# EAGLE design LoRa-Power (EAGLE 7.7.0)
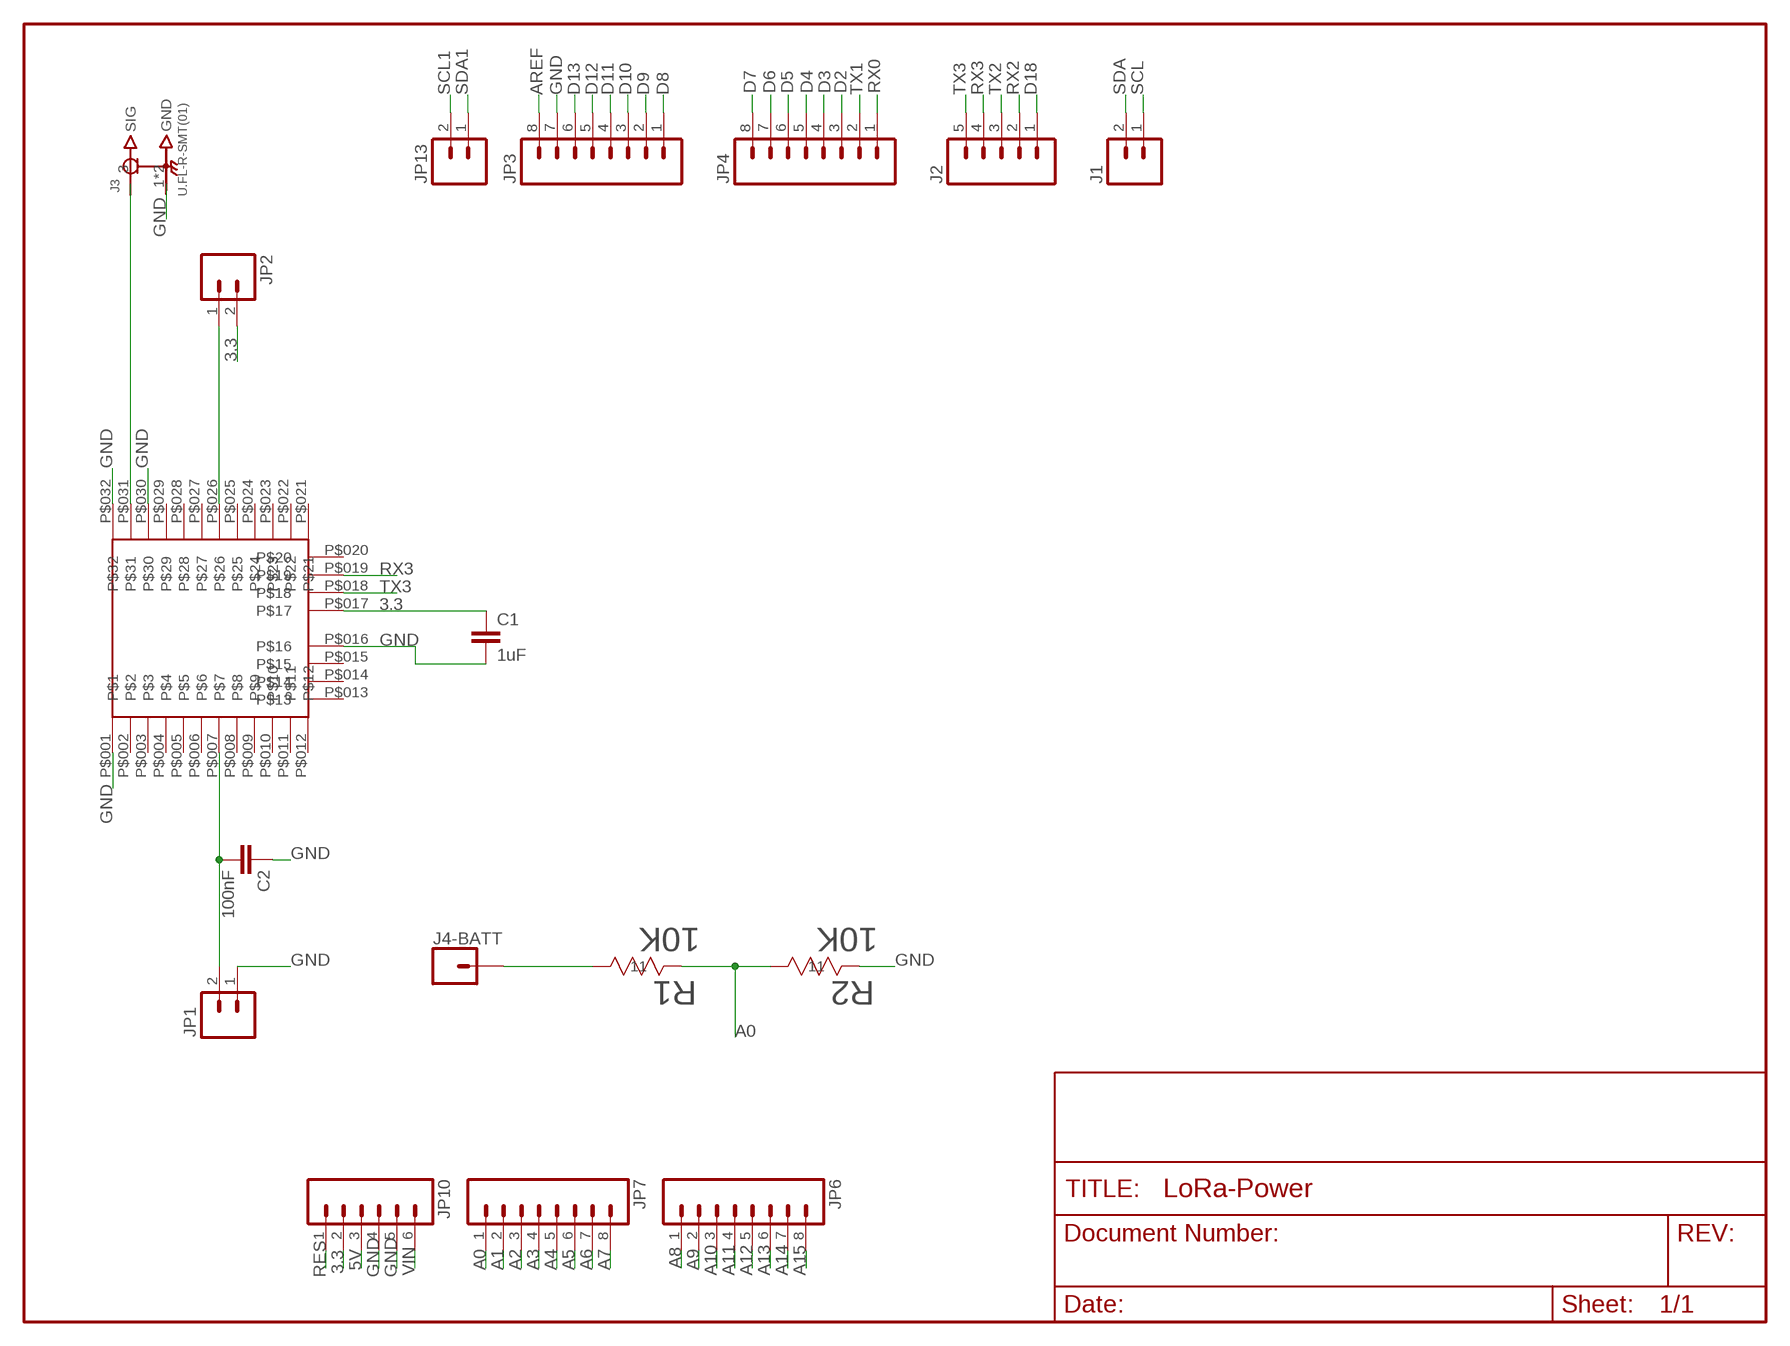
[diagram p0: schematic, sheet 1, part 1 of 2]
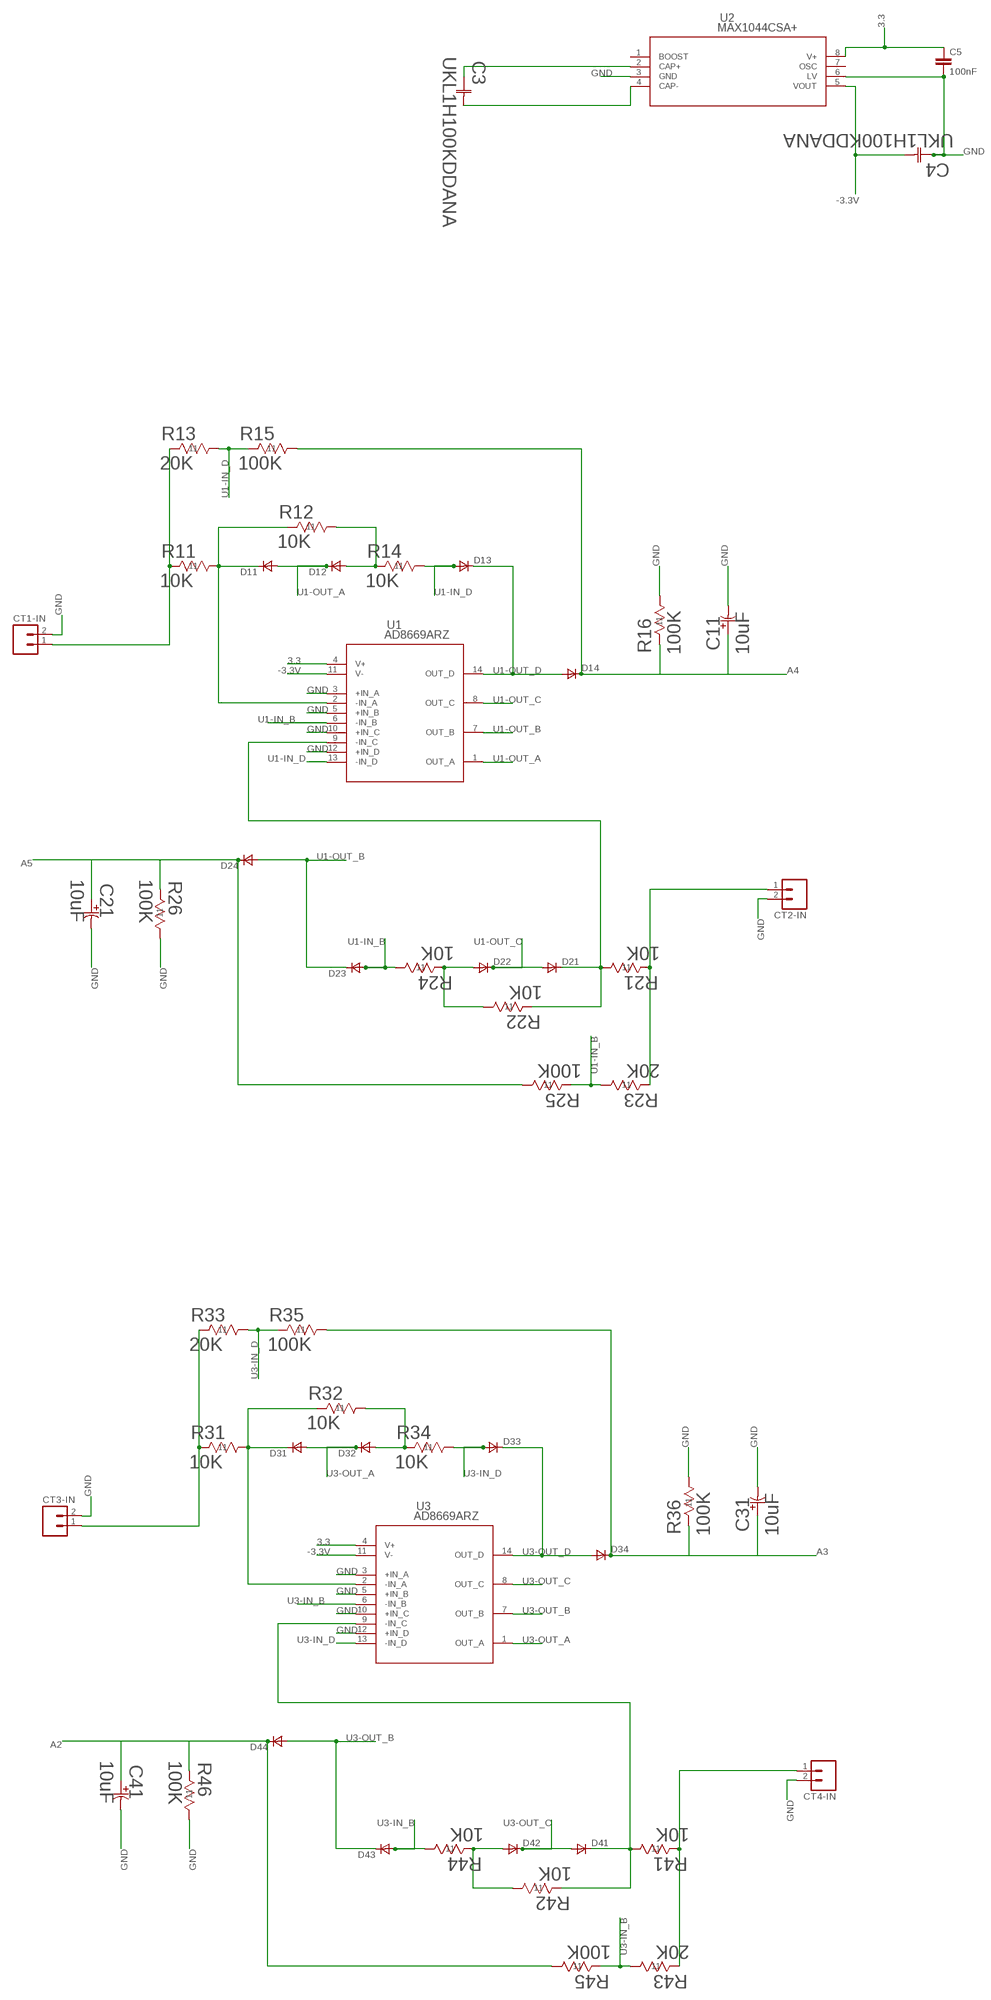
[diagram p1: schematic, sheet 1, part 2 of 2]

## Parts
C1  1uF  C-EUC0603K  [C0603K]
C2  100nF  C-EUC0603K  [C0603K]
C3  UKL1H100KDDANA  [U1-E]
C4  UKL1H100KDDANA  [U1-E]
C5  100nF  C-EUC1206K  [C1206K]
C11  10uF  C1206C106J8RACTU  [C1206]
C21  10uF  C1206C106J8RACTU  [C1206]
C31  10uF  C1206C106J8RACTU  [C1206]
C41  10uF  C1206C106J8RACTU  [C1206]
CT1-IN  M02LOCK  [1X02_LOCK]
CT2-IN  M02LOCK  [1X02_LOCK]
CT3-IN  M02LOCK  [1X02_LOCK]
CT4-IN  M02LOCK  [1X02_LOCK]
D11  DSOT23  [SOT-23]
D12  DSOT23  [SOT-23]
D13  DSOT23  [SOT-23]
D14  DSOT23  [SOT-23]
D21  DSOT23  [SOT-23]
D22  DSOT23  [SOT-23]
D23  DSOT23  [SOT-23]
D24  DSOT23  [SOT-23]
D31  DSOT23  [SOT-23]
D32  DSOT23  [SOT-23]
D33  DSOT23  [SOT-23]
D34  DSOT23  [SOT-23]
D41  DSOT23  [SOT-23]
D42  DSOT23  [SOT-23]
D43  DSOT23  [SOT-23]
D44  DSOT23  [SOT-23]
IM1  IM880B  [IM880B]
J1  M02LOCK  [1X02_LOCK]
J2  M05LOCK  [1X05_LOCK]
J3  U.FL-R-SMT(01)  [HRS_U.FL-R-SMT(01)]
J4-BATT  CONN_01  [1X01]
JP1  M02LOCK  [1X02_LOCK]
JP2  M02LOCK  [1X02_LOCK]
JP3  M08LOCK  [1X08_LOCK]
JP4  M08LOCK  [1X08_LOCK]
JP6  M08LOCK  [1X08_LOCK]
JP7  M08LOCK  [1X08_LOCK]
JP10  M06LOCK  [1X06_LOCK]
JP13  M02LOCK  [1X02_LOCK]
R1  10K  ERA-8AEB103V  [1206]
R2  10K  ERA-8AEB103V  [1206]
R11  10K  ERA-8AEB103V  [1206]
R12  10K  ERA-8AEB103V  [1206]
R13  20K  ERA-8AEB103V  [1206]
R14  10K  ERA-8AEB103V  [1206]
R15  100K  ERA-8AEB103V  [1206]
R16  100K  ERA-8AEB103V  [1206]
R21  10K  ERA-8AEB103V  [1206]
R22  10K  ERA-8AEB103V  [1206]
R23  20K  ERA-8AEB103V  [1206]
R24  10K  ERA-8AEB103V  [1206]
R25  100K  ERA-8AEB103V  [1206]
R26  100K  ERA-8AEB103V  [1206]
R31  10K  ERA-8AEB103V  [1206]
R32  10K  ERA-8AEB103V  [1206]
R33  20K  ERA-8AEB103V  [1206]
R34  10K  ERA-8AEB103V  [1206]
R35  100K  ERA-8AEB103V  [1206]
R36  100K  ERA-8AEB103V  [1206]
R41  10K  ERA-8AEB103V  [1206]
R42  10K  ERA-8AEB103V  [1206]
R43  20K  ERA-8AEB103V  [1206]
R44  10K  ERA-8AEB103V  [1206]
R45  100K  ERA-8AEB103V  [1206]
R46  100K  ERA-8AEB103V  [1206]
U1  AD8669ARZ  [R_14]
U2  MAX1044CSA+  [21-0041B_8]
U3  AD8669ARZ  [R_14]

## Nets
3.3: C1.1 C5.1 IM1.P$017 JP2.2 JP10.2 U1.4(V+) U2.8(V+) U3.4(V+)
5V: JP10.3
-3.3V: C4.2 U1.11(V-) U2.5(VOUT) U3.11(V-)
A0: JP7.1 R1.1 R2.2
A1: JP7.2
A2: C41.1 D44.1(C) JP7.3 R45.2 R46.1
A3: C31.1 D34.1(C) JP7.4 R35.2 R36.1
A4: C11.1 D14.1(C) JP7.5 R15.2 R16.1
A5: C21.1 D24.1(C) JP7.6 R25.2 R26.1
A6: JP7.7
A7: JP7.8
A8: JP6.1
A9: JP6.2
A10: JP6.3
A11: JP6.4
A12: JP6.5
A13: JP6.6
A14: JP6.7
A15: JP6.8
AREF: JP3.8
D2: JP4.3
D3: JP4.4
D4: JP4.5
D5: JP4.6
D6: JP4.7
D7: JP4.8
D8: JP3.1
D9: JP3.2
D10: JP3.3
D11: JP3.4
D12: JP3.5
D13: JP3.6
D18: J2.1
GND: C1.2 C2.1 C4.1 C5.2 C11.2 C21.2 C31.2 C41.2 CT1-IN.2 CT2-IN.2 CT3-IN.2 CT4-IN.2 IM1.P$001 IM1.P$016 IM1.P$030 IM1.P$032 J3.1(GND) J3.2(GND) JP1.1 JP3.7 JP10.4 JP10.5 R2.1 R16.2 R26.2 R36.2 R46.2 U1.3(+IN_A) U1.5(+IN_B) U1.10(+IN_C) U1.12(+IN_D) U2.3(GND) U2.6(LV) U3.3(+IN_A) U3.5(+IN_B) U3.10(+IN_C) U3.12(+IN_D)
N$1: IM1.P$031 J3.3(SIG)
N$2: C2.2 IM1.P$007 JP1.2
N$3: IM1.P$026 JP2.1
N$4: C3.1 U2.2(CAP+)
N$5: C3.2 U2.4(CAP-)
N$6: CT1-IN.1 R11.1 R13.1
N$7: D11.1(C) R11.2 R12.1 U1.2(-IN_A)
N$8: D12.3(A) R12.2 R14.1
N$9: CT2-IN.1 R21.1 R23.1
N$10: D21.1(C) R21.2 R22.1 U1.9(-IN_C)
N$11: D22.3(A) R22.2 R24.1
N$12: CT3-IN.1 R31.1 R33.1
N$13: D31.1(C) R31.2 R32.1 U3.2(-IN_A)
N$14: D32.3(A) R32.2 R34.1
N$15: CT4-IN.1 R41.1 R43.1
N$16: D41.1(C) R41.2 R42.1 U3.9(-IN_C)
N$17: D42.3(A) R42.2 R44.1
N$18: J4-BATT.1 R1.2
RES: JP10.1
RX0: JP4.1
RX2: J2.2
RX3: IM1.P$019 J2.4
SCL: J1.1
SCL1: JP13.2
SDA: J1.2
SDA1: JP13.1
TX1: JP4.2
TX2: J2.3
TX3: IM1.P$018 J2.5
U1-IN_B: D23.3(A) R23.2 R24.2 R25.1 U1.6(-IN_B)
U1-IN_D: D13.3(A) R13.2 R14.2 R15.1 U1.13(-IN_D)
U1-OUT_A: D11.3(A) D12.1(C) U1.1(OUT_A)
U1-OUT_B: D23.1(C) D24.3(A) U1.7(OUT_B)
U1-OUT_C: D21.3(A) D22.1(C) U1.8(OUT_C)
U1-OUT_D: D13.1(C) D14.3(A) U1.14(OUT_D)
U3-IN_B: D43.3(A) R43.2 R44.2 R45.1 U3.6(-IN_B)
U3-IN_D: D33.3(A) R33.2 R34.2 R35.1 U3.13(-IN_D)
U3-OUT_A: D31.3(A) D32.1(C) U3.1(OUT_A)
U3-OUT_B: D43.1(C) D44.3(A) U3.7(OUT_B)
U3-OUT_C: D41.3(A) D42.1(C) U3.8(OUT_C)
U3-OUT_D: D33.1(C) D34.3(A) U3.14(OUT_D)
VIN: JP10.6
Unconnected: IM1.P$002 IM1.P$003 IM1.P$004 IM1.P$005 IM1.P$006 IM1.P$008 IM1.P$009 IM1.P$010 IM1.P$011 IM1.P$012 IM1.P$013 IM1.P$014 IM1.P$015 IM1.P$020 IM1.P$021 IM1.P$022 IM1.P$023 IM1.P$024 IM1.P$025 IM1.P$027 IM1.P$028 IM1.P$029 U2.1(BOOST) U2.7(OSC)

## Library data of the parts
C1 C2 = resistor:C-EU: CAPACITOR, European symbol
C3 C4 = CAP-ELT-UKL1H100K:UKL1H100KDDANA; MANUFACTURER_PART_NUMBER: UKL1H100KDDANA; VENDOR: Nichicon
C5 = rcl:C-EU: CAPACITOR, European symbol
C11 C21 C31 C41 = kemet-cap-cer:C1206C106J8RACTU; MANUFACTURER_PART_NUMBER: C1206C106J8RACTU; VENDOR: KEMET
CT1-IN CT2-IN CT3-IN CT4-IN J1 JP13 = SparkFun-Connectors:M02: Standard 2-pin 0.1" header. Use with - straight break away headers ( PRT-00116) - right angle break away headers (PRT-00553) - swiss pins (PRT-00743) - machine pins (PRT-00117) - female headers (PRT-00115) Molex polarized connector foot print use with: PRT-08233 with associated crimp pins and housings. 2.54_SCREWTERM for use with PRT-10571. 3.5mm Screw Terminal footprints for PRT-08084 5mm Screw Terminal footprints for use with PRT-08432
D11-D14 D21-D24 D31-D34 D41-D44 = zetex:D: DIODE; MPN: CDSOT23-T03; OC_FARNELL: 1824866; OC_NEWARK: 75K7096
IM1 = IM880B:IM880B
J2 = SparkFun-Connectors:M05: Header 5 Standard 5-pin 0.1" header. Use with straight break away headers (SKU : PRT-00116), right angle break away headers (PRT-00553), swiss pins (PRT-00743), machine pins (PRT-00117), and female headers (PRT-00115). Molex polarized connector foot print use with SKU : PRT-08230 with associated crimp pins and housings.
J3 = U.FL-R-SMT_01_:U.FL-R-SMT(01): U.FL Series 6 Ghz 50 Ohm Ultra-small SMT Coaxial Cable Receptacle; AVAILABILITY: Good; DESCRIPTION: U.FL Series 6 Ghz 50 Ohm Ultra-small SMT Coaxial Cable Receptacle; MF: Hirose; MP: U.FL-R-SMT(01); PACKAGE: None; PRICE: 0.86 USD
J4-BATT = SparkFun-Connectors:CONN_01: Single connection point. Often used as Generic Header-pin footprint for 0.1 inch spaced/style header connections On any of the 0.1 inch spaced packages, you can populate with these: Break Away Headers - Straight <https://www.sparkfun.com/products/116> (PRT-00116) Break Away Male Headers - Right Angle <https://www.sparkfun.com/products/553> (PRT-00553) Female Headers <https://www.sparkfun.com/products/115> (PRT-00115) Break Away Headers - Machine Pin <https://www.sparkfun.com/products/117> (PRT-00117) Break Away Female Headers - Swiss Machine Pin <https://www.sparkfun.com/products/743> (PRT-00743) This device is also useful as a general connection point to wire up your design to another part of your project. Our various solder wires solder well into these plated through hole pads. Hook-Up Wire - Assortment (Stranded, 22 AWG) <https://www.sparkfun.com/products/11375> (PRT-11375) Hook-Up Wire - Assortment (Solid Core, 22 AWG) <https://www.sparkfun.com/products/11367> (PRT-11367) View the entire wire category on our website here <https://www.sparkfun.com/categories/141> Special notes: SMTSO-256-ET is a "flush mount" nut for a 4-40 screw. We mostly use this on specialty testbeds; it is a nice way to connect hardware to your PCB at an adjustable hieght. Also note, the SNAP packages are for using a snappable style connector. We sell a baggie of snaps and they are also used on two LilyPad designs: Snap Assortment - 30 pack (male and female) <https://www.sparkfun.com/products/11347> (DEV-11347) LilyPad Arduino SimpleSnap <https://www.sparkfun.com/products/10941> (DEV-10941) LilyPad SimpleSnap Protoboard <https://www.sparkfun.com/products/10940> (DEV-10940)
JP1 JP2 = SparkFun:M02: Header 2 Standard 2-pin 0.1" header. Use with straight break away headers (SKU : PRT-00116), right angle break away headers (PRT-00553), swiss pins (PRT-00743), machine pins (PRT-00117), and female headers (PRT-00115). Molex polarized connector foot print use with SKU : PRT-08233 with associated crimp pins and housings.
JP3 JP4 JP6 JP7 = SparkFun:M08: Header 8 Standard 8-pin 0.1" header. Use with straight break away headers (SKU : PRT-00116), right angle break away headers (PRT-00553), swiss pins (PRT-00743), machine pins (PRT-00117), and female headers (PRT-00115).
JP10 = SparkFun:M06: Header 6 Standard 6-pin 0.1" header. Use with straight break away headers (SKU : PRT-00116), right angle break away headers (PRT-00553), swiss pins (PRT-00743), machine pins (PRT-00117), and female headers (PRT-00115). Molex polarized connector foot print use with SKU : PRT-08094 with associated crimp pins and housings. NOTES ON THE VARIANTS LOCK and LOCK_LONGPADS... This footprint was designed to help hold the alignment of a through-hole component (i.e. 6-pin header) while soldering it into place. You may notice that each hole has been shifted either up or down by 0.005 of an inch from it's more standard position (which is a perfectly straight line). This slight alteration caused the pins (the squares in the middle) to touch the edges of the holes. Because they are alternating, it causes a "brace" to hold the component in place. 0.005 has proven to be the perfect amount of "off-center" position when using our standard breakaway headers. Although looks a little odd when you look at the bare footprint, once you have a header in there, the alteration is very hard to notice. Also, if you push a header all the way into place, it is covered up entirely on the bottom side. This idea of altering the position of holes to aid alignment will be further integrated into the Sparkfun Library for other footprints. It can help hold any component with 3 or more connection pins.
R1 R2 R11-R16 R21-R26 R31-R36 R41-R46 = RES-ERA-Panasonic:ERA-8AEB103V; MANUFACTURER_PART_NUMBER: ERA8AEB103V; VENDOR: Panasonic
U1 U3 = AD8669:AD8669ARZ; MANUFACTURER_PART_NUMBER: AD8669ARZ; VENDOR: Analog Devices Inc
U2 = max1044:MAX1044CSA+; MANUFACTURER_PART_NUMBER: MAX1044CSA+; VENDOR: Maxim Integrated Products

## Board
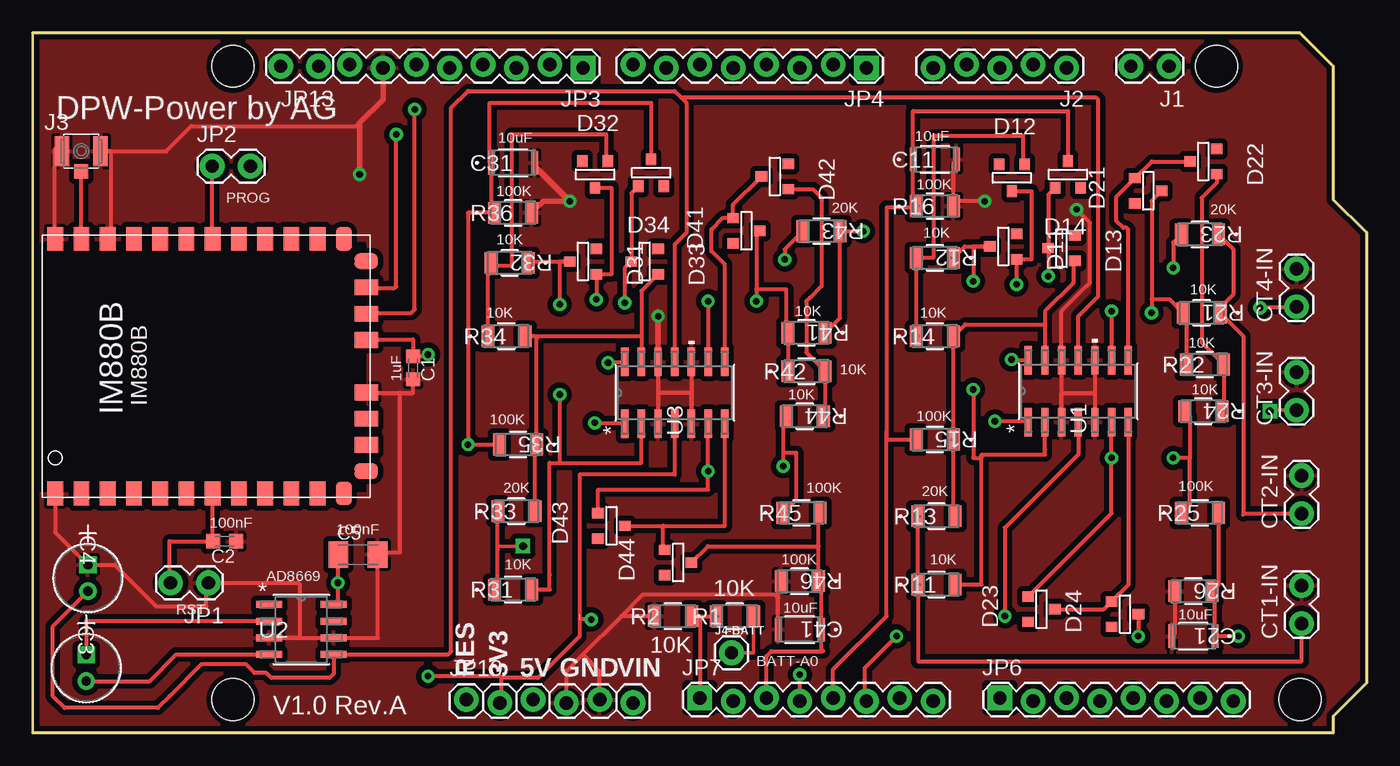
[diagram p2: board, top side]
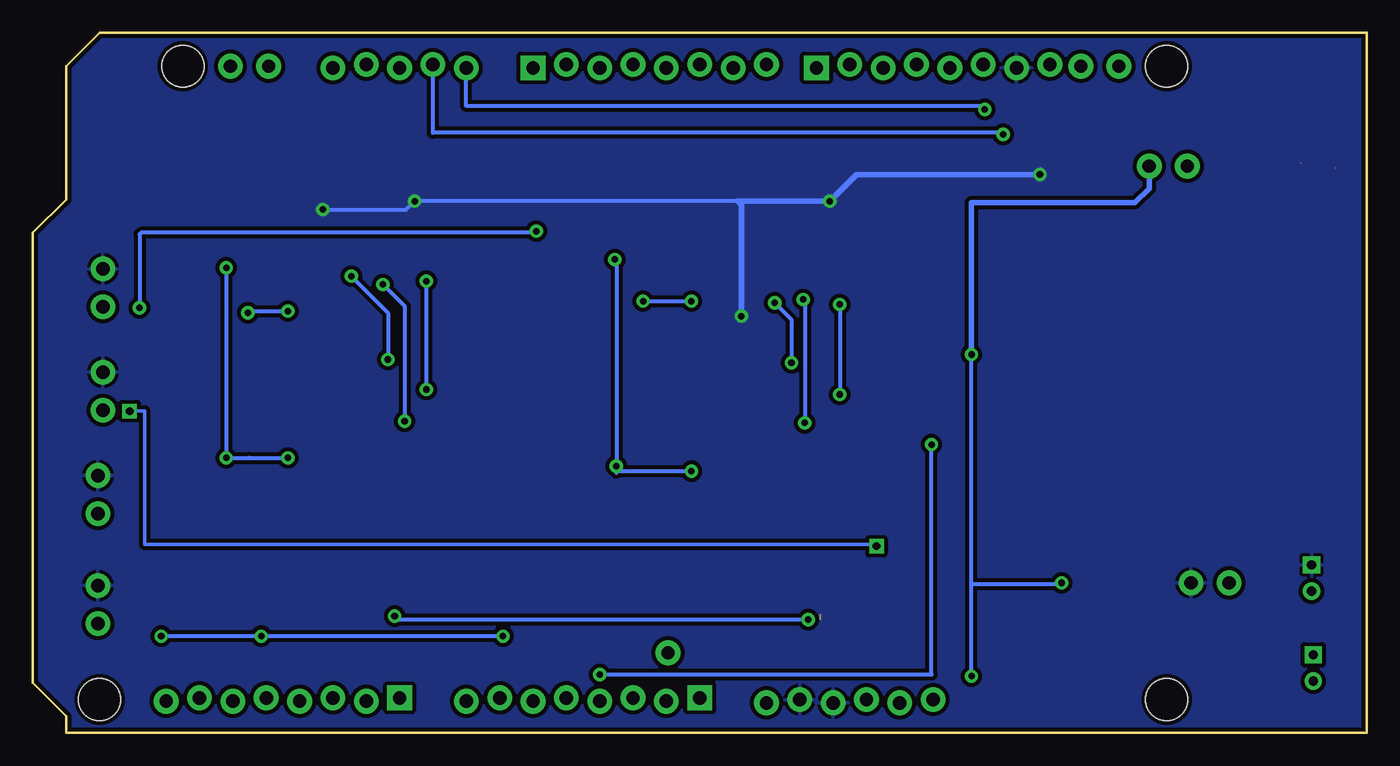
[diagram p3: board, bottom side, seen from below]

Size 101.6 x 53.34 mm. Coordinates in mm from the lower left corner, seen from the top.
Outline: 0,0 99.06,0 99.06,1.27 101.6,3.81 101.6,38.1 99.06,40.64 99.06,50.8 96.52,53.34 0,53.34 0,0
Copper layers (1*16): Top 0.035mm / dielectric 1.5mm / Bottom 0.035mm
Design rules "SparkFun": minimum track width 8mil, minimum drill 20mil, track to track 8mil, track to pad 8mil, pad to pad 8mil, via to via 8mil, smd to smd 8mil, copper to edge 10mil, drill to drill 8mil, minimum pad ring 12mil, minimum via ring 10mil, stop-mask expansion 4mil, vias tented up to drill 25mil, thermal gap 10mil
Holes 3.2 mm at 15.24,50.8 15.24,2.54 90.17,50.8 96.52,2.54

### Footprints (pad centres in the part's own frame; a part is rotated, then mirrored left to right if it is on the bottom)
C0603K = smd 1.05 x 1.08: 1 -0.875,0; 2 0.875,0
U1-E = drill 0.711 pad 1.219 square: 1 -2.007,0 | drill 0.711 pad 1.219: 2 0,0
C1206K = smd 1.5 x 2: 1 -1.5,0; 2 1.5,0
C1206 = smd 0.508 x 1.803: 1 -1.651,0; 2 1.651,0
1X02_LOCK = drill 1.016 pad 1.88: 1 -0.178,0; 2 2.718,0
SOT-23 = smd 0.787 x 0.889: 1 0.025,-1.016; 2 -0.94,1.016; 3 0.991,1.016
IM880B = smd 1.8 x 1.2: P$001 -9.7,11; P$002 -9.7,9; P$003 -9.7,7; P$004 -9.7,5; P$005 -9.7,3; P$006 -9.7,1; P$007 -9.7,-1; P$008 -9.7,-3; P$009 -9.7,-5; P$010 -9.7,-7; P$011 -9.7,-9; P$012 -9.7,-11; P$021 9.7,-11; P$022 9.7,-9; P$023 9.7,-7; P$024 9.7,-5; P$025 9.7,-3; P$026 9.7,-1; P$027 9.7,1; P$028 9.7,3; P$029 9.7,5; P$030 9.7,7; P$031 9.7,9; P$032 9.7,11 | smd 1.2 x 1.8: P$013 -8,-12.7; P$014 -6,-12.7; P$015 -4,-12.7; P$016 -2,-12.7; P$017 2,-12.7; P$018 4,-12.7; P$019 6,-12.7; P$020 8,-12.7
1X05_LOCK = drill 1.016 pad 1.88: 1 0,0.127; 2 2.54,-0.127; 3 5.08,0.127; 4 7.62,-0.127; 5 10.16,0.127
HRS_U.FL-R-SMT(01) = smd 1.1 x 2.25: 1 -1.475,0; 2 1.475,0 | smd 1.05 x 1.1: 3 0,-1.55
1X01 = drill 1.016 pad 1.88: 1 0,0
1X08_LOCK = drill 1.016 pad 1.88 square: 1 0,0.127 | drill 1.016 pad 1.88: 2 2.54,-0.127; 3 5.08,0.127; 4 7.62,-0.127; 5 10.16,0.127; 6 12.7,-0.127; 7 15.24,0.127; 8 17.78,-0.127
1X06_LOCK = drill 1.016 pad 1.88: 1 0,0; 2 2.54,-0.254; 3 5.08,0; 4 7.62,-0.254; 5 10.16,0; 6 12.7,-0.254
1206 = smd 0.965 x 1.651: 1 -1.422,0; 2 1.422,0
R_14 = smd 2.184 x 0.559: 1 -2.362,3.81; 2 -2.362,2.54; 3 -2.362,1.27; 4 -2.362,0; 5 -2.362,-1.27; 6 -2.362,-2.54; 7 -2.362,-3.81; 8 2.362,-3.81; 9 2.362,-2.54; 10 2.362,-1.27; 11 2.362,0; 12 2.362,1.27; 13 2.362,2.54; 14 2.362,3.81
21-0041B_8 = smd 1.981 x 0.533: 1 -2.464,1.905; 2 -2.464,0.635; 3 -2.464,-0.635; 4 -2.464,-1.905; 5 2.464,-1.905; 6 2.464,-0.635; 7 2.464,0.635; 8 2.464,1.905

### Placement (x,y rotation side)
C1  28.96,27.81 270 top
C2  14.61,14.61 180 top
C3  4.06,3.94 270 top
C4  4.19,10.79 270 top
C5  24.77,13.59 0 top
C11  68.71,43.69 0 top
C21  88.39,7.37 180 top
C31  36.58,43.43 0 top
C41  58.42,7.87 180 top
CT1-IN  96.65,8.51 90 top
CT2-IN  96.65,16.89 90 top
CT3-IN  96.27,24.77 90 top
CT4-IN  96.27,32.64 90 top
D11  73.91,37.08 270 top
D12  74.55,42.29 0 top
D13  78.36,36.96 270 top
D14  78.87,42.55 180 top
D21  84.96,41.27 90 top
D22  89.15,43.56 270 top
D23  76.83,9.4 90 top
D24  83.19,9.02 90 top
D31  41.91,35.94 270 top
D32  42.8,42.55 0 top
D33  46.61,35.94 270 top
D34  47.12,42.67 180 top
D41  54.36,38.23 90 top
D42  56.52,42.42 270 top
D43  44.07,15.75 90 top
D44  49.15,12.95 90 top
IM1  12.7,27.94 90 top
J1  86.36,50.8 180 top
J2  78.74,50.8 180 top
J3  3.68,44.32 0 top
J4-BATT  53.21,6.1 0 top
JP1  13.21,11.43 180 top
JP2  13.84,43.18 0 top
JP3  41.91,50.8 180 top
JP4  63.5,50.8 180 top
JP6  73.66,2.54 0 top
JP7  50.8,2.54 0 top
JP10  33.02,2.54 0 top
JP13  21.59,50.8 180 top
R1  53.47,8.89 0 top
R2  48.77,8.89 0 top
R11  68.83,11.3 0 top
R12  68.71,36.2 180 top
R13  68.83,16.51 0 top
R14  68.71,30.23 0 top
R15  68.71,22.35 180 top
R16  68.71,40.13 0 top
R21  89.03,32 180 top
R22  89.28,28.07 0 top
R23  88.9,37.97 180 top
R24  89.15,24.51 180 top
R25  88.9,16.76 0 top
R26  88.39,10.79 180 top
R31  36.58,10.92 0 top
R32  36.32,35.81 180 top
R33  36.83,16.89 0 top
R34  36.07,30.23 0 top
R35  36.96,21.97 180 top
R36  36.58,39.62 0 top
R41  58.93,30.48 180 top
R42  58.93,27.56 0 top
R43  60.07,38.23 180 top
R44  58.8,24.13 180 top
R45  58.55,16.76 0 top
R46  58.42,11.56 180 top
U1  79.63,26.04 90 top
U2  20.45,7.87 0 top
U3  48.9,25.91 90 top

### Tracks (layer width: path | path; a pad name or v marks a point on that pad's centre or on a via)
3.3  (via drill 0.5)  (1 unrouted)
  Top 0.305: JP10.2 35.69,2.41 35.69,4.19 | 35.69,4.19 35.56,4.32 v30.1,4.32 | v30.1,28.83 29.96,28.69 C1.1 28.96,29.97 25.43,29.97 IM1.P$017 | C5.1 23.27,10.13 U2.8 23.24,10.11 v23.24,11.43 | 35.69,4.19 38.48,4.19 41.66,7.37 41.66,9.02 41.66,19.68 48.9,19.68 U3.4 | U1.4 79.63,21.21 74.04,15.62 v74.04,8.89 | v42.55,8.64 41.66,8.64
  Bottom 0.305: v30.1,4.32 30.1,11.3 | 30.1,11.3 v30.1,28.83 | v23.24,11.43 23.37,11.3 30.1,11.3 | v74.04,8.89 73.79,8.64 v42.55,8.64
  Bottom 0.406: JP2.2 16.56,41.48 17.65,40.39 30.1,40.39 v30.1,28.83
-3.3V
  Top 0.305: 49.4,48.39 48.9,48.9 33.15,48.9 31.88,47.62 31.88,6.22 31.62,5.97 23.5,5.97 U2.5 22.91,4.5 22.61,4.19 18.16,4.19 17.78,4.57 16.89,4.57 16.26,5.21 12.83,5.21 10.41,2.79 9.53,1.91 2.41,1.91 1.52,2.79 1.52,8.13 C4.2 | 49.4,48.39 49.78,48.01 49.78,38.1 48.9,37.21 U3.11 | U1.11 79.63,31.75 81.15,33.27 81.15,48.26 81.03,48.39 49.4,48.39
A0
  Top 0.305: R1.1 R2.2 50.8,8.89 JP7.1
A2
  Top 0.305: 59.84,14.22 R46.1 60.07,11.33 C41.1 60.07,6.35 60.2,6.22 56.26,6.22 55.88,5.84 JP7.3 | 59.84,14.22 59.84,16.64 R45.2 | D44.1 51.41,14.22 59.84,14.22
A3  (via drill 0.5)
  Top 0.305: D34.1 47.09,48.01 34.8,48.01 34.8,43.43 C31.1 34.92,39.85 R36.1 33.15,39.62 33.15,22.1 | 33.15,22.1 v33.15,21.97 | v33.15,21.97 R35.2 | JP7.4 v58.42,4.45 | v33.15,21.97 33.15,22.1
  Bottom 0.305: v58.42,4.45 33.15,4.45 v33.15,21.97
A4
  Top 0.305: R16.1 67.31,40.11 67.31,40.01 | 67.31,40.01 67.06,40.26 C11.1 67.18,43.69 67.18,43.94 67.06,43.94 67.06,47.37 78.84,47.37 D14.1 | 67.31,40.01 65.02,40.01 65.02,39.5 65.02,22.99 | 65.02,22.99 65.02,22.35 R15.2 | JP7.5 60.96,4.83 65.02,8.89 65.02,22.99
A5  (via drill 0.5)
  Top 0.305: JP7.6 63.5,2.54 63.37,2.67 63.37,4.95 v65.79,7.37 | v91.82,7.37 C21.1 90.04,10.57 R26.1 90.32,11.3 R25.2 | D24.1 v84.2,7.37
  Bottom 0.305: v65.79,7.37 83.82,7.37 | 83.82,7.37 v84.2,7.37 | v84.2,7.37 v91.82,7.37 | v84.2,7.37 83.82,7.37
GND  (via drill 0.5)
  Top 0.305: IM1.P$030 5.97,37.91 5.97,44.32 J3.2 10.16,44.32 12.06,46.23 24.64,46.23 24.89,46.48 | IM1.P$032 1.65,37.69 1.65,44.45 1.78,44.32 J3.1 | IM1.P$016 25.43,25.91 | 25.43,25.91 28.96,25.91 C1.2 | R26.2 86.97,7.59 C21.2 | U3.12 47.62,25.91 | 47.62,25.91 U3.3 | U3.10 50.16,25.91 | 50.16,25.91 U3.5 50.16,25.91 | 50.16,25.91 47.62,25.91 | v72.52,40.51 70.51,40.51 R16.2 70.13,43.46 C11.2 | v79.5,39.88 80.52,38.86 80.52,34.29 80.26,34.04 78.36,32.13 U1.12 U1.3 78.36,25.91 80.9,25.91 | U1.10 80.9,25.91 | 80.9,25.91 U1.5 | C41.2 56.77,10.29 | 56.77,10.29 56.77,11.33 R46.2 | JP10.4 40.64,4.7 41.91,5.97 | 41.91,5.97 44.83,8.89 | 44.83,8.89 46.48,10.54 56.52,10.54 56.77,10.29 | JP10.5 43.18,4.7 41.91,5.97 | IM1.P$001 1.7,15.29 C4.1 6.25,12.8 9.4,9.65 13.21,9.65 13.21,11.25 JP1.1 20.19,11.43 20.32,11.3 20.32,7.24 U2.3 23.5,7.24 26.27,7.24 C5.2 26.27,13.72 27.94,13.72 27.94,25.91 25.43,25.91 | R2.1 44.83,8.89
  Top 0.406: JP3.7 26.67,48.26 24.89,46.48 v24.89,42.55 | R36.2 38.89,40.51 v40.89,40.51 38.23,43.18 C31.2 | U3.12 v47.62,31.75
  Bottom 0.305: 47.88,40.51 v72.52,40.51 73.15,39.88 v79.5,39.88
  Bottom 0.406: v24.89,42.55 38.86,42.55 v40.89,40.51 47.88,40.51 47.62,40.26 v47.62,31.75
  pour Bottom (isolate 0.305): 0,0 99.06,0 99.06,1.27 101.6,3.81 101.6,38.1 99.06,40.64 99.06,50.8 96.52,53.34 0,53.34
  pour Top (isolate 0.406): 0.38,52.96 0.38,37.59 25.53,37.59 25.53,37.34 25.53,18.16 0.38,18.16 0.38,0.25 98.68,0.25 98.68,1.4 98.81,1.4 101.35,3.94 101.35,37.85 98.68,40.51 98.68,50.55 98.93,50.8 98.68,50.8 96.52,52.96 1.14,52.96 1.02,53.09
N$1
  Top 0.305: IM1.P$031 3.68,37.66 J3.3
N$2
  Top 0.305: JP1.2 10.41,11.51 10.41,14.61 C2.2 13.7,14.63 IM1.P$007
N$3
  Top 0.305: IM1.P$026 13.66,37.67 JP2.1
N$4
  Top 0.305: U2.2 4.06,8.51 C3.1
N$5
  Top 0.305: C3.2 8.89,3.94 10.92,5.97 U2.4
N$6
  Top 0.305: 67.44,11.3 R11.1 67.44,11.3 | 67.44,11.3 67.44,11.43 67.41,11.43 R13.1 | 67.44,11.3 67.44,5.46 96.65,5.46 CT1-IN.1
N$7  (via drill 0.5)
  Top 0.305: R12.1 70.99,37.06 D11.1 71.63,37.06 v71.63,34.42 | R11.2 72.26,11.3 72.26,20.95 | 72.26,20.95 72.26,21.21 77.09,21.21 77.09,21.59 U1.2 | v71.63,26.16 71.63,20.95 72.26,20.95
  Bottom 0.305: v71.63,34.42 v71.63,26.16
N$8
  Top 0.305: D12.3 75.44,43.31 75.44,45.47 68.83,45.47 68.58,45.47 68.58,36.2 R12.2 R14.1
N$9
  Top 0.305: R23.1 91.44,36.85 91.44,33.4 90.45,32.41 R21.1 92.2,30.25 92.2,16.64 92.28,16.71 CT2-IN.1
N$10  (via drill 0.5)
  Top 0.305: D21.1 85.22,40.54 85.22,33.02 | 85.22,33.02 v85.22,32 | v82.17,32.13 U1.9 | 85.22,33.02 86.59,33.02 R21.2 87.86,31.75 R22.1
  Bottom 0.305: v85.22,32 85.09,32.13 v82.17,32.13
N$11
  Top 0.305: D22.3 90.17,41.91 89.03,40.77 89.03,29.74 R22.2 90.7,24.64 R24.1
N$12  (via drill 0.6)
  Top 0.254: CT3-IN.1 94.23,24.59 v94.23,24.51 | v37.34,14.22 35.41,14.22 35.41,13.97
  Top 0.305: R31.1 35.41,10.92 35.41,13.97 R33.1
  Bottom 0.254: v94.23,24.51 93.09,24.51 93.09,14.35 37.34,14.35 v37.34,14.22
N$13  (via drill 0.5)
  Top 0.305: R32.1 37.85,35.92 D31.1 40.13,35.92 v40.13,32.64 | R31.2 39.37,10.92 39.37,12.06 39.37,20.57 40.13,20.57 | 40.13,20.57 46.35,20.57 46.35,21.21 U3.2 | v40.13,25.78 40.13,20.57
  Bottom 0.305: v40.13,32.64 v40.13,25.78
N$14
  Top 0.305: D32.3 43.69,43.56 43.69,45.59 36.45,45.59 36.45,35.56 34.9,35.56 R32.2 34.65,35.81 R34.1
N$15  (via drill 0.5)
  Top 0.305: R41.1 61.49,31.62 R43.1 v63.25,38.23 | v93.47,32.38 93.55,32.46 CT4-IN.1
  Bottom 0.305: v63.25,38.23 63.37,38.1 93.34,38.1 93.47,37.97 v93.47,32.38
N$16  (via drill 0.5)
  Top 0.305: R42.1 R41.2 57.4,30.58 57.4,33.78 55.12,33.78 | D41.1 55.12,38 55.12,33.78 | 55.12,33.78 v55.12,32.89 | v51.44,32.89 U3.9
  Bottom 0.305: v55.12,32.89 v51.44,32.89
N$17
  Top 0.305: D42.3 59.41,41.43 60.07,40.77 60.07,34.04 59.18,33.15 58.93,32.89 58.93,28.98 R42.2 60.35,24.26 R44.1
N$18
  Top 0.254: J4-BATT.1 54.89,6.1 R1.2
RX3  (via drill 0.5)
  Top 0.305: IM1.P$019 25.43,33.91 27.56,33.91 27.69,34.04 v27.69,45.59
  Bottom 0.305: v27.69,45.59 27.81,45.72 71.12,45.72 J2.4
TX3  (via drill 0.5)
  Top 0.305: IM1.P$018 25.46,32 28.83,32 29.08,32.26 v29.08,47.5
  Bottom 0.305: v29.08,47.5 29.34,47.75 68.58,47.75 J2.5
U1-IN_B  (via drill 0.5)
  Top 0.305: R23.2 86.87,37.36 v86.87,35.43 | U1.6 v82.17,20.95 82.17,16.74 D23.3 | R24.2 88.14,24.11 88.14,20.95 | 88.14,20.95 v86.87,20.95 | R25.1 88.14,17.42 88.14,20.95
  Bottom 0.305: v86.87,35.43 v86.87,20.95 | v86.87,20.95 85.09,20.95 | 85.09,20.95 v82.17,20.95 | v86.87,20.95 85.09,20.95
U1-IN_D
  Top 0.305: R13.2 70.13,16.51 R15.1 R14.2 71.02,31.11 77.09,31.11 | D13.3 79.25,35.84 79.25,34.29 77.09,32.13 77.09,31.11 | 77.09,31.11 U1.13
U1-OUT_A  (via drill 0.5)
  Top 0.305: D12.1 76.07,41.27 76.07,36.07 74.93,36.07 D11.3 v74.93,34.16 | v73.28,23.75 75.82,23.75 U1.1
  Bottom 0.305: v74.93,34.16 73.28,32.51 73.28,32.38 v73.28,23.75
U1-OUT_B
  Top 0.305: D23.1 81.58,9.42 D24.3 83.44,11.28 U1.7
U1-OUT_C
  Top 0.305: U1.8 83.44,38.35 83.31,38.48 83.06,38.48 82.55,38.99 82.55,40.87 D21.3 85.22,43.54 D22.1
U1-OUT_D  (via drill 0.5)
  Top 0.305: D14.3 77.34,41 D13.1 v77.34,34.8 | v74.55,28.45 74.6,28.4 U1.14
  Bottom 0.305: v77.34,34.8 74.55,32 v74.55,28.45
U3-IN_B  (via drill 0.5)
  Top 0.305: R43.2 57.28,36.85 v57.28,36.07 | U3.6 v51.44,19.94 51.44,18.54 43.05,18.54 D43.3 | R44.2 57.15,23.9 57.15,21.34 | 57.15,21.34 v57.15,20.32 | R45.1 58.17,17.8 58.17,21.34 57.15,21.34
  Bottom 0.305: v57.28,36.07 57.15,35.94 v57.15,20.32 | v57.15,20.32 57.15,20.07 | 57.15,20.07 57.15,19.81 57.02,19.94 v51.44,19.94 | v57.15,20.32 57.15,20.07
U3-IN_D
  Top 0.305: R33.2 38.25,21.84 R35.1 38.38,30.07 38.23,30.23 R34.2 46.35,30.23 | 46.35,30.23 U3.13 | D33.3 46.35,33.68 46.35,30.23
U3-OUT_A  (via drill 0.5)
  Top 0.305: D32.1 44.07,41.53 44.07,34.92 42.93,34.92 D31.3 v42.93,33.02 | v42.8,23.62 45.09,23.62 U3.1
  Bottom 0.305: v42.93,33.02 42.8,33.02 v42.8,23.62
U3-OUT_B
  Top 0.305: D43.1 48.01,15.77 | 48.01,15.77 52.7,15.77 U3.7 | D44.3 48.01,13.95 48.01,15.77
U3-OUT_C
  Top 0.305: U3.8 52.7,35.69 51.69,36.7 51.69,38.35 52.58,39.24 53.31,39.24 D41.3 53.34,40.23 D42.1
U3-OUT_D  (via drill 0.5)
  Top 0.305: D34.3 45.59,41.12 D33.1 45.09,35.41 v45.09,32.77 | v43.81,28.19 43.89,28.27 U3.14
  Bottom 0.305: v45.09,32.77 43.81,31.5 v43.81,28.19

### Text on the board
tPlace: DPW-Power by AG | 10uF | 10uF | 100K | 100K | PROG | 20K | 20K | 10K | 10K | 10K | 10K | 10K | 10K | 10K | 1uF | 10K | 10K | 10K | IM880B | 100K | 100K | 20K | 100K | 20K | 100K | 100nF | 100nF | 100K | 10K | AD8669 | 10K | 10K | RST | 10uF | 10uF | 10K | BATT-A0 | RES | 3V3 | 5V | GND | VIN | V1.0 Rev.A